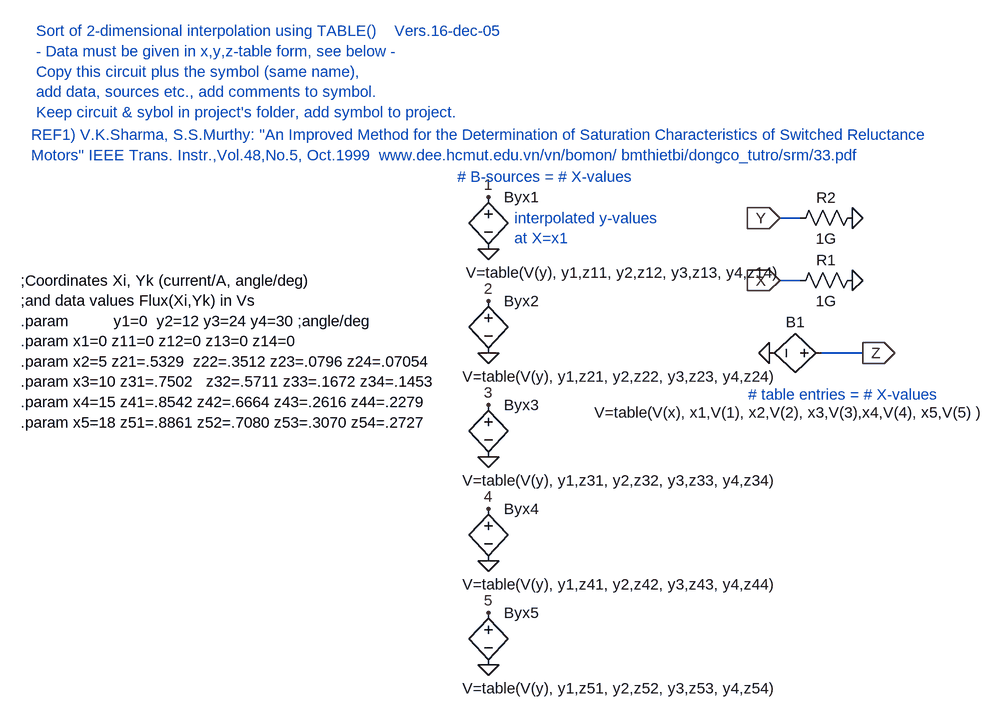
[diagram p0: schematic 2D_Interpolation_Flux.asc]
2D_Interpolation_Flux.asc, the LTspice schematic file:
Version 4
SHEET 1 1612 708
WIRE 1024 -128 992 -128
WIRE 1024 -32 992 -32
WIRE 1120 80 1056 80
FLAG 544 -80 0
FLAG 544 -160 1
FLAG 544 80 0
FLAG 544 0 2
FLAG 976 80 0
FLAG 1120 80 Z
IOPIN 1120 80 Out
FLAG 544 240 0
FLAG 544 160 3
FLAG 992 -32 X
IOPIN 992 -32 In
FLAG 1104 -32 0
FLAG 992 -128 Y
IOPIN 992 -128 In
FLAG 1104 -128 0
FLAG 544 400 0
FLAG 544 320 4
FLAG 544 560 0
FLAG 544 480 5
SYMBOL bv 1072 80 R90
WINDOW 3 76 65 VTop 0
WINDOW 0 -32 56 VBottom 0
SYMATTR Value V=table(V(x), x1,V(1), x2,V(2), x3,V(3),x4,V(4), x5,V(5) )
SYMATTR InstName B1
SYMBOL bv 544 -176 R0
WINDOW 3 -35 132 Left 0
SYMATTR Value V=table(V(y), y1,z11, y2,z12, y3,z13, y4,z14)
SYMATTR InstName Byx1
SYMBOL bv 544 -16 R0
WINDOW 3 -40 132 Left 0
SYMATTR Value V=table(V(y), y1,z21, y2,z22, y3,z23, y4,z24)
SYMATTR InstName Byx2
SYMBOL bv 544 144 R0
WINDOW 3 -40 132 Left 0
SYMATTR Value V=table(V(y), y1,z31, y2,z32, y3,z33, y4,z34)
SYMATTR InstName Byx3
SYMBOL res 1008 -16 R270
WINDOW 0 32 56 VTop 0
WINDOW 3 0 56 VBottom 0
SYMATTR InstName R1
SYMATTR Value 1G
SYMBOL res 1008 -112 R270
WINDOW 0 32 56 VTop 0
WINDOW 3 0 56 VBottom 0
SYMATTR InstName R2
SYMATTR Value 1G
SYMBOL bv 544 304 R0
WINDOW 3 -40 132 Left 0
SYMATTR Value V=table(V(y), y1,z41, y2,z42, y3,z43, y4,z44)
SYMATTR InstName Byx4
SYMBOL bv 544 464 R0
WINDOW 3 -40 132 Left 0
SYMATTR Value V=table(V(y), y1,z51, y2,z52, y3,z53, y4,z54)
SYMATTR InstName Byx5
TEXT -176 -32 Left 0 !;Coordinates Xi, Yk (current/A, angle/deg)\n;and data values Flux(Xi,Yk) in Vs\n.param          y1=0  y2=12 y3=24 y4=30 ;angle/deg\n.param x1=0 z11=0 z12=0 z13=0 z14=0\n.param x2=5 z21=.5329  z22=.3512 z23=.0796 z24=.07054\n.param x3=10 z31=.7502   z32=.5711 z33=.1672 z34=.1453\n.param x4=15 z41=.8542 z42=.6664 z43=.2616 z44=.2279\n.param x5=18 z51=.8861 z52=.7080 z53=.3070 z54=.2727
TEXT 944 144 Left 0 ;# table entries = # X-values
TEXT -152 -416 Left 0 ;Sort of 2-dimensional interpolation using TABLE()    Vers.16-dec-05\n- Data must be given in x,y,z-table form, see below -\nCopy this circuit plus the symbol (same name),\nadd data, sources etc., add comments to symbol.\nKeep circuit & sybol in project's folder, add symbol to project.
TEXT 496 -192 Left 0 ;# B-sources = # X-values
TEXT 584 -128 Left 0 ;interpolated y-values\nat X=x1
TEXT -160 -256 Left 0 ;REF1) V.K.Sharma, S.S.Murthy: "An Improved Method for the Determination of Saturation Characteristics of Switched Reluctance\nMotors" IEEE Trans. Instr.,Vol.48,No.5, Oct.1999  www.dee.hcmut.edu.vn/vn/bomon/ bmthietbi/dongco_tutro/srm/33.pdf

The netlist it stands for:
* 2D_Interpolation_Flux.asc
B1 Z 0 V=table(V(x), x1,V(1), x2,V(2), x3,V(3),x4,V(4), x5,V(5) )
Byx1 1 0 V=table(V(y), y1,z11, y2,z12, y3,z13, y4,z14)
Byx2 2 0 V=table(V(y), y1,z21, y2,z22, y3,z23, y4,z24)
Byx3 3 0 V=table(V(y), y1,z31, y2,z32, y3,z33, y4,z34)
R1 X 0 1G
R2 Y 0 1G
Byx4 4 0 V=table(V(y), y1,z41, y2,z42, y3,z43, y4,z44)
Byx5 5 0 V=table(V(y), y1,z51, y2,z52, y3,z53, y4,z54)
;Coordinates Xi, Yk (current/A, angle/deg)
;and data values Flux(Xi,Yk) in Vs
.param          y1=0  y2=12 y3=24 y4=30 ;angle/deg
.param x1=0 z11=0 z12=0 z13=0 z14=0
.param x2=5 z21=.5329  z22=.3512 z23=.0796 z24=.07054
.param x3=10 z31=.7502   z32=.5711 z33=.1672 z34=.1453
.param x4=15 z41=.8542 z42=.6664 z43=.2616 z44=.2279
.param x5=18 z51=.8861 z52=.7080 z53=.3070 z54=.2727
* # table entries = # X-values
* Sort of 2-dimensional interpolation using TABLE()    Vers.16-dec-05
* - Data must be given in x,y,z-table form, see below -
* Copy this circuit plus the symbol (same name),
* add data, sources etc., add comments to symbol.
* Keep circuit & sybol in project's folder, add symbol to project.
* # B-sources = # X-values
* interpolated y-values
* at X=x1
* REF1) V.K.Sharma, S.S.Murthy: "An Improved Method for the Determination of Saturation Characteristics of Switched Reluctance
* Motors" IEEE Trans. Instr.,Vol.48,No.5, Oct.1999  www.dee.hcmut.edu.vn/vn/bomon/ bmthietbi/dongco_tutro/srm/33.pdf
.backanno
.end